# EAGLE design Callisto_Header_Test_Board_All_On (EAGLE 9.6.2)
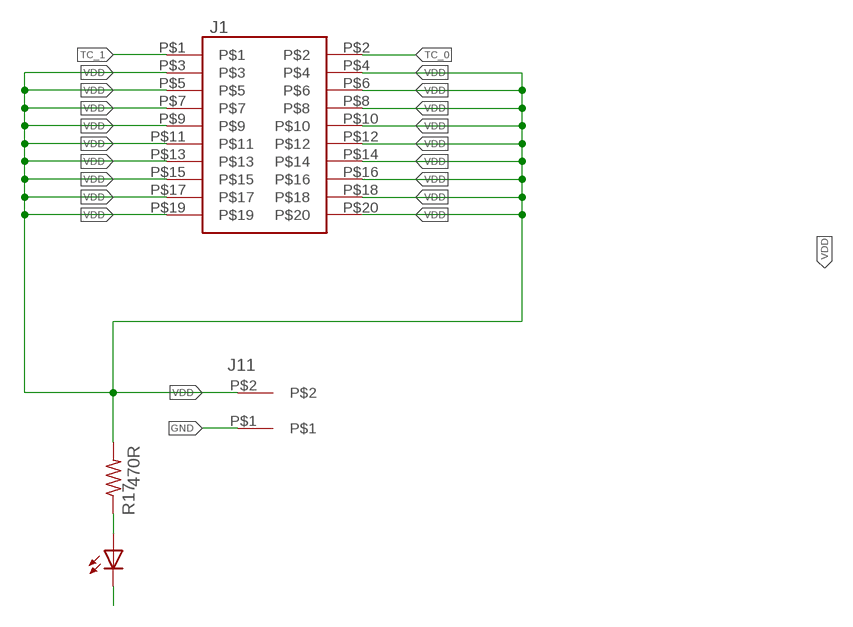
[diagram p0: schematic, sheet 1]

## Parts
J1  20-pos  2_X_10_HEADER_GENERIC  [2_X_10_.1_INCH]
J11  2-pos  3.81MM_1_X_2_RT_ANGLE_PLUG_HEADER  [2_3.81MM_PITCH]
LED17  Green  LED_0805_GREEN  [0805]
R17  470R  R_0402  [0402]

## Nets
GND: J11.P$1 LED17.2(C)
N$17: LED17.1(A) R17.P$1
TC_0: J1.P$2
TC_1: J1.P$1
VDD: J1.P$3 J1.P$4 J1.P$5 J1.P$6 J1.P$7 J1.P$8 J1.P$9 J1.P$10 J1.P$11 J1.P$12 J1.P$13 J1.P$14 J1.P$15 J1.P$16 J1.P$17 J1.P$18 J1.P$19 J1.P$20 J11.P$2 R17.P$2

## Library data of the parts
J1 = 3D_MIG_Controller:2_X_10_HEADER_GENERIC: CONN HEADER R/A 20POS 2.54MM, Straight, Right Angle; PARTNO: 67996-420HLF
J11 = 3D_MIG_Controller:3.81MM_1_X_2_RT_ANGLE_PLUG_HEADER: TERM BLOCK HDR 2POS 90DEG 3.81MM; PARTNO: 691322310002
LED17 = 3D_MIG_Controller:LED_0805_GREEN: Green 570nm LED Indication - Discrete 2.2V 0805 (2012 Metric); PARTNO: LG R971-KN-1
R17 = 3D_MIG_Controller:R_0402

## Board
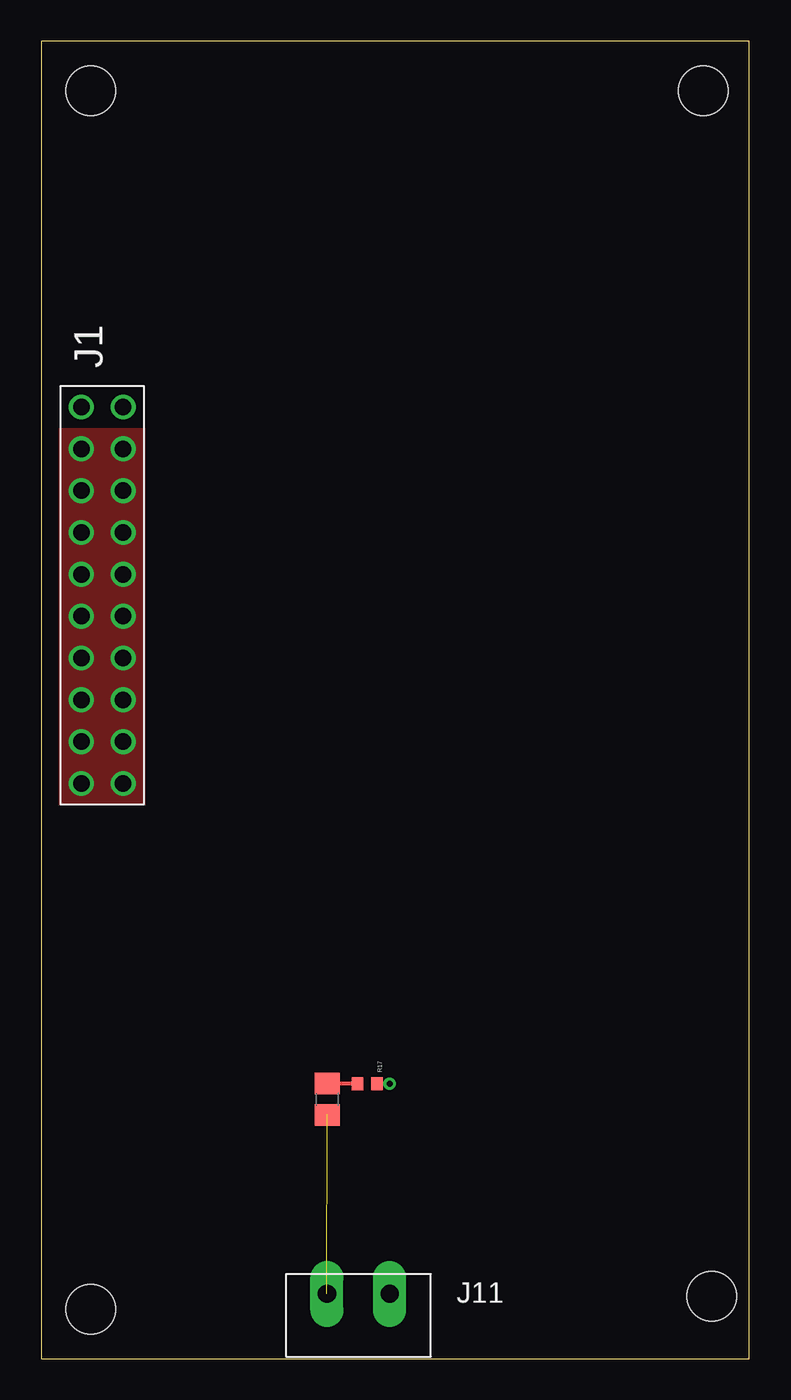
[diagram p1: board, top side]
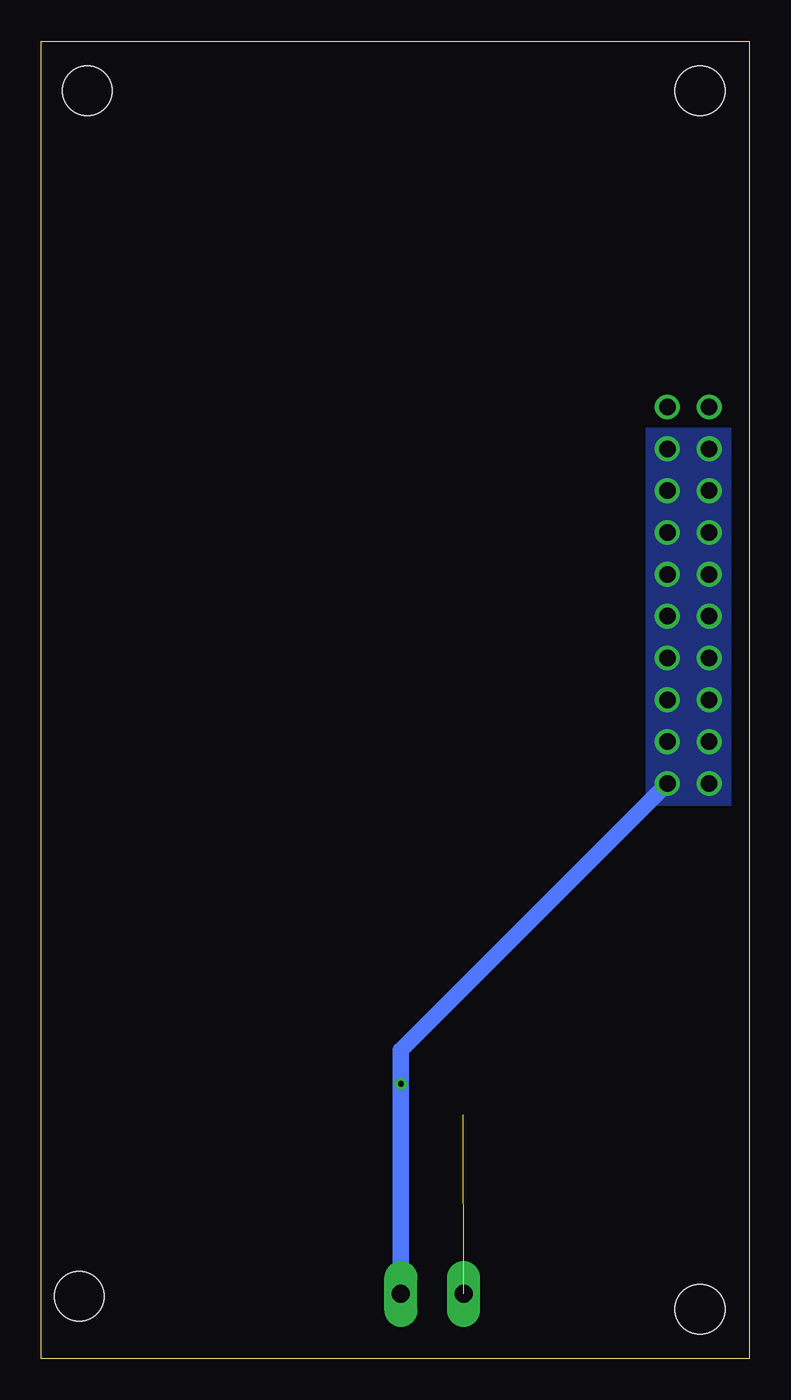
[diagram p2: board, bottom side, seen from below]

Size 43 x 80 mm. Coordinates in mm from the lower left corner, seen from the top.
Outline: 0,0 43,0 43,80 0,80 0,0
Copper layers (1*16): Top 0.035mm / dielectric 1.5mm / Bottom 0.035mm
Design rules "default": minimum track width 6mil, minimum drill 0.35mm, track to track 6mil, track to pad 6mil, pad to pad 6mil, via to via 6mil, smd to smd 6mil, copper to edge 40mil, drill to drill 6mil, minimum pad ring 10mil, minimum via ring 8mil, stop-mask expansion 4mil, vias tented up to drill 0mil, thermal gap 10mil
Holes 3 mm at 3,3 40.7,3.8 3,77 40.2,77

### Footprints (pad centres in the part's own frame; a part is rotated, then mirrored left to right if it is on the bottom)
2_X_10_.1_INCH = drill 1: P$1 -11.43,-1.27; P$2 -11.43,1.27; P$3 -8.89,-1.27; P$4 -8.89,1.27; P$5 -6.35,-1.27; P$6 -6.35,1.27; P$7 -3.81,-1.27; P$8 -3.81,1.27; P$9 -1.27,-1.27; P$10 -1.27,1.27; P$11 1.27,-1.27; P$12 1.27,1.27; P$13 3.81,-1.27; P$14 3.81,1.27; P$15 6.35,-1.27; P$16 6.35,1.27; P$17 8.89,-1.27; P$18 8.89,1.27; P$19 11.43,-1.27; P$20 11.43,1.27
2_3.81MM_PITCH = drill 1.1 pad 2 long: P$1 0,0; P$2 3.81,0
0805 = smd 1.3 x 1.5: 1 -0.95,0; 2 0.95,0
0402 = smd 0.8 x 0.7: P$1 0,0.6; P$2 0,-0.6

### Placement (x,y rotation side)
J1  3.71,46.36 270 top
J11  17.35,3.94 0 top
LED17  17.37,15.76 270 top
R17  19.8,16.7 90 top

### Tracks (layer width: path | path; a pad name or v marks a point on that pad's centre or on a via)
GND  (1 unrouted)
N$17
  Top 0.254: R17.P$1 LED17.1
VDD  (via drill 0.35)
  Top 0.254: v21.16,16.7 R17.P$2
  Bottom 1.016: J11.P$2 v21.16,16.7 21.16,18.75 J1.P$20
  pour Bottom (no thermals): 1.2,56.5 6.3,56.5 6.3,33.6 1.1,33.6 1.1,33.9 1.1,56.5
  pour Top (no thermals): 1.1,56.5 6.3,56.5 6.3,33.6 1.1,33.6